# Altium schematic sheet 1.0.0_Overall_Rocket_Eletrical.SchDoc: 1.0.0_Overall_Rocket_avionics
size A4; DocumentNumber: 1; SheetNumber: 1; SheetTotal: 14
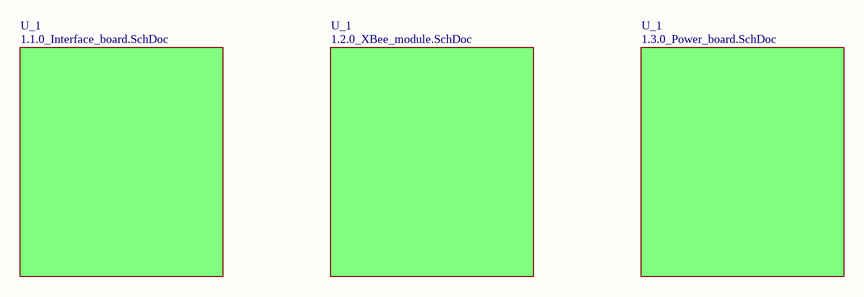
[diagram p0: 1.0.0_Overall_Rocket_Eletrical.SchDoc]

## Sub-sheets
U_1 = 1.1.0_Interface_board.SchDoc: no entries
U_1 = 1.2.0_XBee_module.SchDoc: no entries
U_1 = 1.3.0_Power_board.SchDoc: no entries